# EAGLE design Sensor_GP1A57HRJ00F_board_V_1_0 (EAGLE 9.6.2)
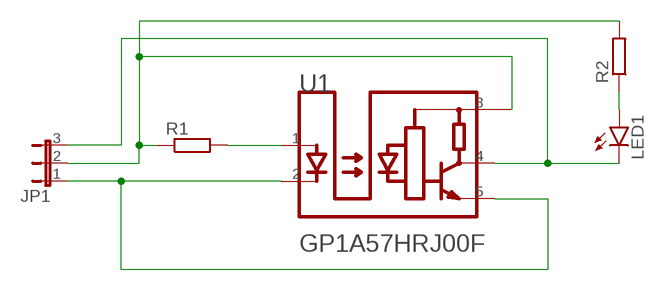
[diagram p0: schematic, sheet 1]

## Parts
JP1  JP2E  [JP2]
LED1  LED3MM  [LED3MM]
R1  R-EU_0309/10  [0309/10]
R2  R-EU_0309/10  [0309/10]
U1  SHARP_GP1A57HRJ00FSHARP_GP1A57HRJ00F_0_0  [SHARP_GP1A57HRJ00F_0]

## Nets
+5VDC: JP1.2 R1.1 R2.2 U1.3(VCC)
GND: JP1.1 U1.2(CATHODE) U1.5(GND)
N$2: R1.2 U1.1(ANODE)
N$4: LED1.A R2.1
SIG: JP1.3 LED1.K(C) U1.4(VO)

## Library data of the parts
JP1 = jumper:JP2E: JUMPER
LED1 = led:LED: LED OSRAM: - CHIPLED LG R971, LG N971, LY N971, LG Q971, LY Q971, LO R971, LY R971 LH N974, LH R974 LS Q976, LO Q976, LY Q976 LO Q996 - Hyper CHIPLED LW Q18S LB Q993, LB Q99A, LB R99A - SideLED LS A670, LO A670, LY A670, LG A670, LP A670 LB A673, LV A673, LT A673, LW A673 LH A674 LY A675 LS A676, LA A676, LO A676, LY A676, LW A676 LS A679, LY A679, LG A679 - Hyper Micro SIDELED® LS Y876, LA Y876, LO Y876, LY Y876 LT Y87S - SmartLED LW L88C, LW L88S LB L89C, LB L89S, LG L890 LS L89K, LO L89K, LY L89K LS L896, LA L896, LO L896, LY L896 - TOPLED LS T670, LO T670, LY T670, LG T670, LP T670 LSG T670, LSP T670, LSY T670, LOP T670, LYG T670 LG T671, LOG T671, LSG T671 LB T673, LV T673, LT T673, LW T673 LH T674 LS T676, LA T676, LO T676, LY T676, LB T676, LH T676, LSB T676, LW T676 LB T67C, LV T67C, LT T67C, LS T67K, LO T67K, LY T67K, LW E67C LS E67B, LA E67B, LO E67B, LY E67B, LB E67C, LV E67C, LT E67C LW T67C LS T679, LY T679, LG T679 LS T770, LO T770, LY T770, LG T770, LP T770 LB T773, LV T773, LT T773, LW T773 LH T774 LS E675, LA E675, LY E675, LS T675 LS T776, LA T776, LO T776, LY T776, LB T776 LHGB T686 LT T68C, LB T68C - Hyper Mini TOPLED® LB M676 - Mini TOPLED Santana® LG M470 LS M47K, LO M47K, LY M47K Source: http://www.osram.convergy.de LUXEON: - LUMILED® LXK2-PW12-R00, LXK2-PW12-S00, LXK2-PW14-U00, LXK2-PW14-V00 LXK2-PM12-R00, LXK2-PM12-S00, LXK2-PM14-U00 LXK2-PE12-Q00, LXK2-PE12-R00, LXK2-PE12-S00, LXK2-PE14-T00, LXK2-PE14-U00 LXK2-PB12-K00, LXK2-PB12-L00, LXK2-PB12-M00, LXK2-PB14-N00, LXK2-PB14-P00, LXK2-PB14-Q00 LXK2-PR12-L00, LXK2-PR12-M00, LXK2-PR14-Q00, LXK2-PR14-R00 LXK2-PD12-Q00, LXK2-PD12-R00, LXK2-PD12-S00 LXK2-PH12-R00, LXK2-PH12-S00 LXK2-PL12-P00, LXK2-PL12-Q00, LXK2-PL12-R00 Source: www.luxeon.com KINGBRIGHT: KA-3528ASYC Source: www.kingbright.com
R1 R2 = resistor:R-EU_: RESISTOR, European symbol
U1 = Sharp - GP1A57HRJ00F:SHARP_GP1A57HRJ00F: PHOTOINTER OPIC SLOT 10MM PCB; CENTROID_NOT_SPECIFIED: No; DATASHEET: https://cdn.sharpsde.com/fileadmin/products/Optoelectronics/Isolation%20Devices/Specs_Photointerrupter/GP1A57HRJ00F_03Oct05_DS_D3-A03901FEN.pdf; DEVICE_CLASS_L1: Sensors; DEVICE_CLASS_L2: Optical Sensors; DEVICE_CLASS_L3: Photoelectric Sensors; DIGIKEY_DESCRIPTION: IC PHOTOINTER OPIC SLOT 10MM PCB; DIGIKEY_PART_NUMBER: 1855-1043-ND; HEIGHT: 15.4mm; LEAD_FREE: yes; MAX_SUPPLY_VOLTAGE: 17V; MF: Sharp; MFG_PACKAGE_IDENT: GP1A57HRJ00F; MFG_PACKAGE_IDENT_DATE: 0; MFG_PACKAGE_IDENT_REV: 0; MIN_SUPPLY_VOLTAGE: 4.5V; MOUSER_DESCRIPTION: GP1A Series 10 mm 10 V 0.5 us Transmissive Photointerrupter with Connector; MOUSER_PART_NUMBER: 852-GP1A57HRJ00F; MPN: GP1A57HRJ00F; OUTPUT_CURRENT: 50mA; PACKAGE: PTH_18MM6_5MM0; PREFIX: U; ROHS: yes; SENSING_DISTANCE: 10mm; TEMPERATURE_RANGE_HIGH: +85°C; TEMPERATURE_RANGE_LOW: -25°C; VERIFICATION_VERSION: 0.0.0.1

## Board
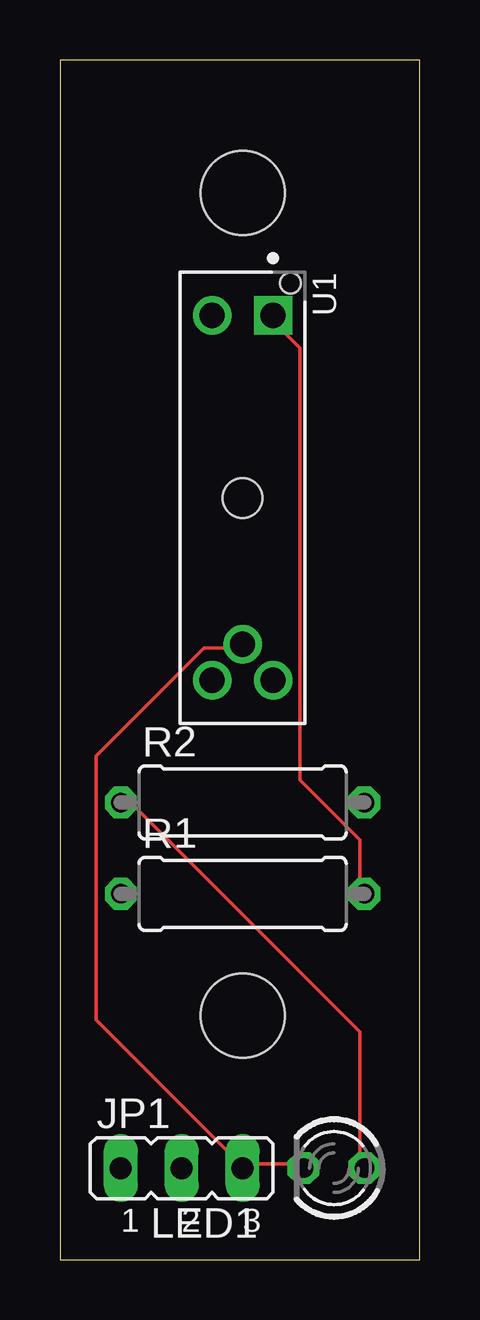
[diagram p1: board, top side]
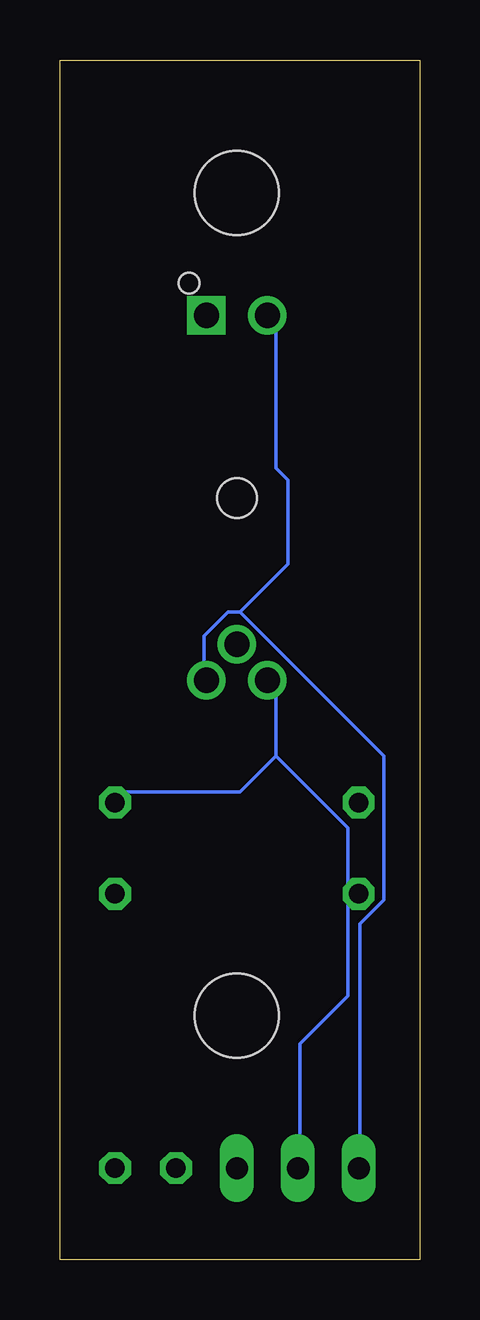
[diagram p2: board, bottom side, seen from below]

Size 15 x 50 mm. Coordinates in mm from the lower left corner, seen from the top.
Outline: 0,0 15,0 15,50 0,50 0,0
Copper layers (1*16): Top 0.035mm / dielectric 1.5mm / Bottom 0.035mm
Design rules "default": minimum track width 6mil, minimum drill 0.35mm, track to track 6mil, track to pad 6mil, pad to pad 6mil, via to via 6mil, smd to smd 6mil, copper to edge 40mil, drill to drill 6mil, minimum pad ring 10mil, minimum via ring 8mil, stop-mask expansion 4mil, vias tented up to drill 0mil, thermal gap 10mil
Holes 3.5 mm at 7.62,44.45 7.62,10.16

### Footprints (pad centres in the part's own frame; a part is rotated, then mirrored left to right if it is on the bottom)
JP2 = drill 0.914 long: 1 -2.54,0; 2 0,0; 3 2.54,0
LED3MM = drill 0.813 octagon: A -1.27,0; K 1.27,0
0309/10 = drill 0.813 octagon: 1 -5.08,0; 2 5.08,0
SHARP_GP1A57HRJ00F_0 = drill 1.05 pad 1.6 square: 1 -7.6,1.27 | drill 1.05 pad 1.6: 2 -7.6,-1.27; 3 7.6,-1.27; 4 6.1,0; 5 7.6,1.27 | hole 1.65: 0,0 | hole 0.85: -8.95,2

### Placement (x,y rotation side)
JP1  5.08,3.81 0 top
LED1  11.43,3.81 180 top
R1  7.62,15.24 0 top
R2  7.62,19.05 0 top
U1  7.62,31.75 270 top

### Tracks (layer width: path | path; a pad name or v marks a point on that pad's centre or on a via)
+5VDC
  Bottom 0.152: 6,21 3,18 3,15.5 R1.1 3,15 3,11 5,9 5,4 JP1.2 | 6,21 6,24 U1.3 | 6,21 7.5,19.5 12.5,19.5 R2.2
GND
  Bottom 0.152: 7.5,27 1.5,21 1.5,15 2.5,14 2.5,4 JP1.1 | 7.5,27 8,27 9,26 9,24.5 U1.5 | 7.5,27 5.5,29 5.5,32.5 6,33 6,39 U1.2
N$2
  Top 0.152: R1.2 12.5,15.5 12.5,17.5 10,20 10,38 9,39 U1.1
N$4
  Top 0.152: R2.1 3,19 12.5,9.5 12.5,4 LED1.A
SIG
  Top 0.152: LED1.K 10,4 8,4 JP1.3 7.5,4 1.5,10 1.5,21 6,25.5 7.5,25.5 U1.4